# EAGLE design switch pcb (EAGLE 9.6.2)
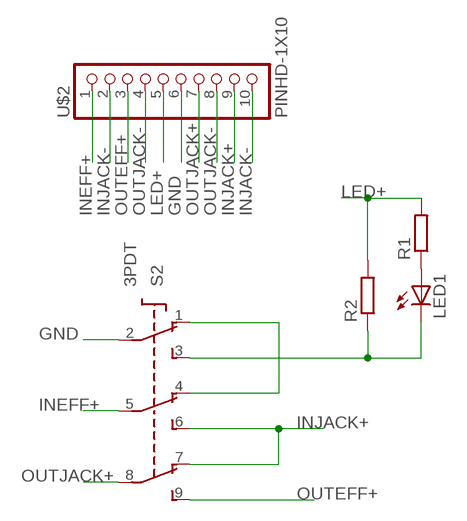
[diagram p0: schematic, sheet 1]

## Parts
LED1  LED3MM  [LED3MM]
R1  R-EU_R0603  [R0603]
R2  R-EU_R0603  [R0603]
S2  3PDT  [3PDT]
U$2  PINHD-1X10  [1X10-BIG]

## Nets
GND: S2.2(P1) U$2.6
INEFF+: S2.5(P2) U$2.1
INJACK+: S2.6(S2) S2.7(O3) U$2.9
INJACK-: U$2.2 U$2.10
LED+: R1.2 R2.2 U$2.5
N$1: LED1.A R1.1
N$2: LED1.K(C) R2.1 S2.3(S1)
N$5: S2.1(O1) S2.4(O2)
OUTEFF+: S2.9(S3) U$2.3
OUTJACK+: S2.8(P3) U$2.7
OUTJACK-: U$2.4 U$2.8

## Library data of the parts
LED1 = adafruit:LED: LED OSRAM: - CHIPLED LG R971, LG N971, LY N971, LG Q971, LY Q971, LO R971, LY R971 LH N974, LH R974 LS Q976, LO Q976, LY Q976 LO Q996 - Hyper CHIPLED LW Q18S LB Q993, LB Q99A, LB R99A - SideLED LS A670, LO A670, LY A670, LG A670, LP A670 LB A673, LV A673, LT A673, LW A673 LH A674 LY A675 LS A676, LA A676, LO A676, LY A676, LW A676 LS A679, LY A679, LG A679 - Hyper Micro SIDELED® LS Y876, LA Y876, LO Y876, LY Y876 LT Y87S - SmartLED LW L88C, LW L88S LB L89C, LB L89S, LG L890 LS L89K, LO L89K, LY L89K LS L896, LA L896, LO L896, LY L896 - TOPLED LS T670, LO T670, LY T670, LG T670, LP T670 LSG T670, LSP T670, LSY T670, LOP T670, LYG T670 LG T671, LOG T671, LSG T671 LB T673, LV T673, LT T673, LW T673 LH T674 LS T676, LA T676, LO T676, LY T676, LB T676, LH T676, LSB T676, LW T676 LB T67C, LV T67C, LT T67C, LS T67K, LO T67K, LY T67K, LW E67C LS E67B, LA E67B, LO E67B, LY E67B, LB E67C, LV E67C, LT E67C LW T67C LS T679, LY T679, LG T679 LS T770, LO T770, LY T770, LG T770, LP T770 LB T773, LV T773, LT T773, LW T773 LH T774 LS E675, LA E675, LY E675, LS T675 LS T776, LA T776, LO T776, LY T776, LB T776 LHGB T686 LT T68C, LB T68C - Hyper Mini TOPLED® LB M676 - Mini TOPLED Santana® LG M470 LS M47K, LO M47K, LY M47K Source: http://www.osram.convergy.de/
R1 R2 = rcl:R-EU_: RESISTOR, European symbol; SPICEPREFIX: R
S2 = switch:3PDT: 3PDT 9 pin footswitch SF17020F-0302-21R-L Source: 3PDT.jpg
U$2 = adafruit:PINHD-1X10: Pin header 1x10 0.1" spacing With round pins

## Board
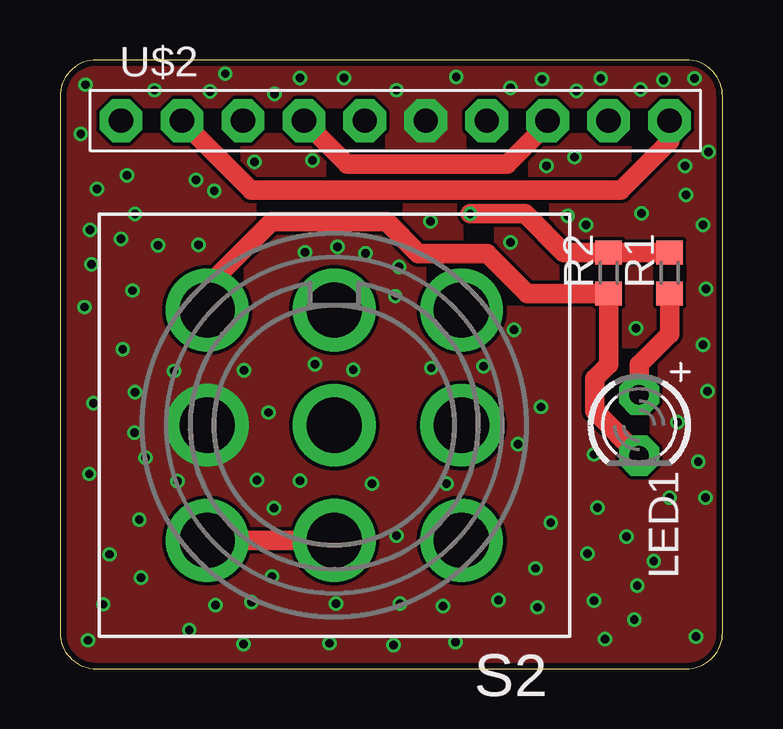
[diagram p1: board, top side]
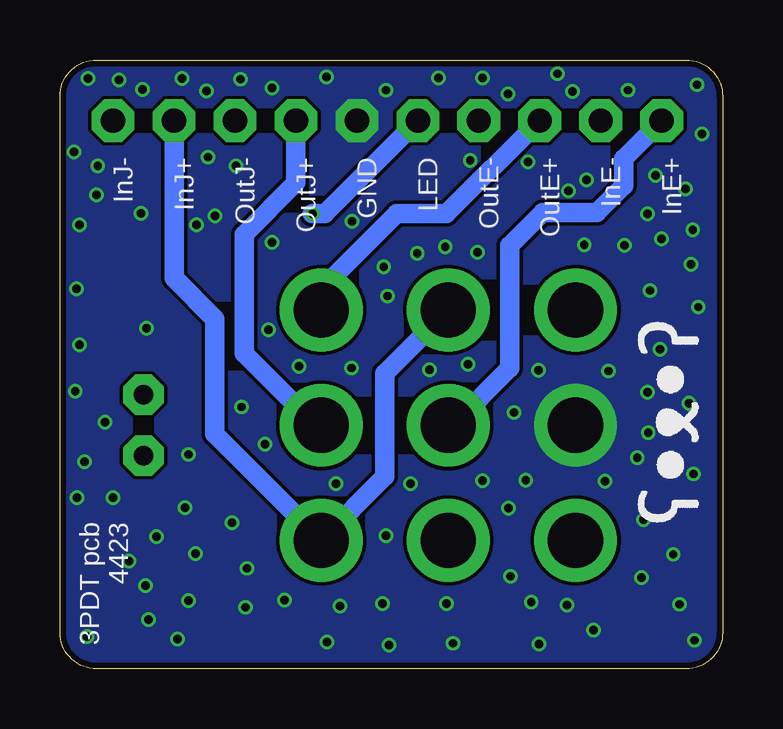
[diagram p2: board, bottom side, seen from below]

Size 27.61 x 25.39 mm. Coordinates in mm from the lower left corner, seen from the top.
Outline: 0,23.87 0,1.52 arc90 1.52,0 26.09,0 arc90 27.61,1.52 27.61,23.87 arc90 26.09,25.39 1.52,25.39 arc90 0,23.87
Copper layers (1*16): Top 0.018mm / dielectric 1.55mm / Bottom 0.018mm
Design rules "eC_2Layer_PClass6_BaseCopperO18_eCDefault": minimum track width 0.15mm, minimum drill 0.35mm, track to track 0.15mm, track to pad 0.15mm, pad to pad 0.15mm, via to via 0.15mm, smd to smd 0mil, copper to edge 0.25mm, drill to drill 0.35mm, minimum pad ring 0.175mm, minimum via ring 0.125mm, stop-mask expansion 0mil, vias tented up to drill 0.45mm, thermal gap 0.2mm

### Footprints (pad centres in the part's own frame; a part is rotated, then mirrored left to right if it is on the bottom)
LED3MM = drill 0.813 pad 1.676 octagon: A -1.27,0; K 1.27,0
R0603 = smd 1 x 1.1: 1 -0.85,0; 2 0.85,0
3PDT = drill 2.3 pad 3.1: 1 5.3,4.8; 2 5.3,0; 3 5.3,-4.8; 4 0,4.8; 5 0,0; 6 0,-4.8; 7 -5.3,4.8; 8 -5.3,0; 9 -5.3,-4.8
1X10-BIG = drill 1.016 pad 1.778 octagon: 1 -11.43,0; 2 -8.89,0; 3 -6.35,0; 4 -3.81,0; 5 -1.27,0; 6 1.27,0; 7 3.81,0; 8 6.35,0; 9 8.89,0; 10 11.43,0

### Placement (x,y rotation side)
LED1  24.13,10.16 270 top
R1  25.4,16.51 90 top
R2  22.86,16.51 90 top
S2  11.43,10.16 180 top
U$2  13.97,22.86 0 top

### Tracks (layer width: path | path; a pad name or v marks a point on that pad's centre or on a via)
GND  (via drill 0.35)
  other vias: 1.02,15.09 1.24,18.31 1.55,20.02 1.4,11.07 1.8,2.69 5.38,1.63 2.06,4.78 24.74,4.5 25.73,10.29 26.8,13.51 24,14.2 26.09,19.76 24.23,19 26.8,18.52 22.25,2.84 23.93,2.06 26.49,1.35 26.9,7.14 22.4,6.73 21.97,4.8 7.65,1.04 1.17,1.19 1.07,24.36 0.86,22.3 3.94,24.13 6.88,24.82 8.94,23.98 11.84,24.64 14.02,24.13 16.51,24.69 18.77,24.23 20.09,24.59 22.53,24.61 21.51,24.1 24.18,24.16 26.44,24.61 27.03,21.56 26.04,20.98 25.15,24.56 21.16,18.9 1.22,8.13 16.48,1.12 11.23,1.07 13.89,0.99 22.71,1.24 23.6,5.51 25.4,7.14 26.97,11.58 26.59,8.64 26.92,15.85 21.44,21.34 10.01,24.64 6.25,24.08 22.25,8.94 2.54,17.93 4.09,17.65 3.02,15.77 2.62,13.34 3.12,11.53 4.75,12.42 3.56,8.81 3.1,9.86 3.3,6.22 3.38,3.81 7.98,2.79 8.2,7.87 8.69,10.69 7.67,12.45 10.62,12.7 12.22,12.47 10.21,17.37 12.73,17.32 13.97,15.54 15.47,12.55 17.65,12.62 16.1,7.72 20.04,10.92 19.08,9.37 20.45,6.1 13,7.72 10.01,7.85 8.84,3.86 6.48,2.67 11.51,2.72 4.9,7.82 5.77,17.68 19.89,2.57 15.95,2.62 14.17,2.72 14.02,5.56 18.26,2.87 19.81,4.19 24.05,3.48 20.27,20.98 5.66,20.4 2.79,20.57 3.12,18.97 14.12,16.76 8.92,6.71 8.1,21.13 10.52,21.21 6.43,19.94 15.44,18.67 18.92,14.15 21.92,18.52 11.56,17.6 1.32,16.87 18.77,17.78
  pour Bottom (no thermals): 0,25.4 0,0 27.94,0 27.94,25.4
  pour Top (no thermals): 0,25.4 0,0 27.94,0 27.94,25.4
INEFF+
  Bottom 0.813: U$2.1 4.12,21.28 4.12,20.14 5.24,19.02 7.49,19.02 8.87,17.65 8.87,12.55 11.25,10.16 S2.5
INJACK+
  Bottom 0.813: U$2.9 22.86,16.29 21.16,14.59 21.16,9.79 S2.7 14.07,8.02 14.07,12.32 S2.6
INJACK-
  Top 0.813: U$2.2 7.98,19.96 23.37,19.96 25.4,22 U$2.10
LED+  (via drill 0.35)
  Top 0.813: R1.2 R2.2 20.99,17.36 19.38,18.97 v17.09,18.97
  Bottom 0.813: U$2.5 16.59,18.97 v17.09,18.97
N$1
  Top 0.813: LED1.A 24.13,12.7 25.4,13.97 R1.1
N$2
  Top 0.813: LED1.K 22.28,10.74 22.28,12.12 22.86,12.7 R2.1 19.47,15.66 17.8,17.32 14.94,17.32 13.61,18.64 8.81,18.64 6.13,15.96 S2.3
N$5
  Top 0.813: S2.1 S2.4
OUTEFF+
  Bottom 0.813: U$2.3 11.51,18.97 13.59,18.97 16.73,15.83 S2.9
OUTJACK+
  Bottom 0.813: U$2.7 17.78,20.27 19.94,18.11 19.94,13.16 16.94,10.16 S2.8
OUTJACK-
  Top 0.813: U$2.4 11.96,21.06 18.64,21.06 20.32,22.73 U$2.8

### Text on the board
bPlace: InE+ | InE- | OutE+ | OutE- | LED | GND | OutJ+ | OutJ- | InJ+ | InJ- | 3PDT pcb / 4423